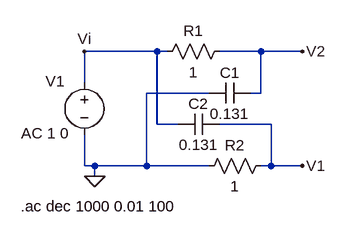
[diagram p0: schematic Pasatodo_Pasivo.asc]
Pasatodo_Pasivo.asc, the LTspice schematic file:
Version 4
SHEET 1 1328 680
WIRE 96 96 -16 96
WIRE 112 96 96 96
WIRE 256 96 192 96
WIRE 320 96 256 96
WIRE -16 144 -16 96
WIRE 176 160 80 160
WIRE 256 160 256 96
WIRE 256 160 240 160
WIRE 96 208 96 96
WIRE 128 208 96 208
WIRE 272 208 192 208
WIRE -16 272 -16 224
WIRE 0 272 -16 272
WIRE 80 272 80 160
WIRE 80 272 0 272
WIRE 176 272 80 272
WIRE 272 272 272 208
WIRE 272 272 256 272
WIRE 320 272 272 272
WIRE 0 288 0 272
FLAG -16 96 Vi
FLAG 320 96 V2
FLAG 320 272 V1
FLAG 0 288 0
SYMBOL voltage -16 128 R0
WINDOW 123 -97 94 Left 2
WINDOW 39 0 0 Left 0
WINDOW 0 -60 14 Left 2
SYMATTR Value2 AC 1 0
SYMATTR InstName V1
SYMATTR Value ""
SYMBOL res 208 80 R90
WINDOW 0 0 56 VBottom 2
WINDOW 3 32 56 VTop 2
SYMATTR InstName R1
SYMATTR Value 1
SYMBOL cap 240 144 R90
WINDOW 0 0 32 VBottom 2
WINDOW 3 32 32 VTop 2
SYMATTR InstName C1
SYMATTR Value 0.131
SYMBOL cap 192 192 R90
WINDOW 0 0 32 VBottom 2
WINDOW 3 32 32 VTop 2
SYMATTR InstName C2
SYMATTR Value 0.131
SYMBOL res 272 256 R90
WINDOW 0 0 56 VBottom 2
WINDOW 3 32 56 VTop 2
SYMATTR InstName R2
SYMATTR Value 1
TEXT -114 334 Left 2 !.ac dec 1000 0.01 100

The netlist it stands for:
* Pasatodo_Pasivo.asc
V1 Vi 0 AC 1 0
R1 V2 Vi 1
C1 V2 0 0.131
C2 V1 Vi 0.131
R2 V1 0 1
.ac dec 1000 0.01 100
.backanno
.end